# EAGLE design roller_sensor (EAGLE 5.03)
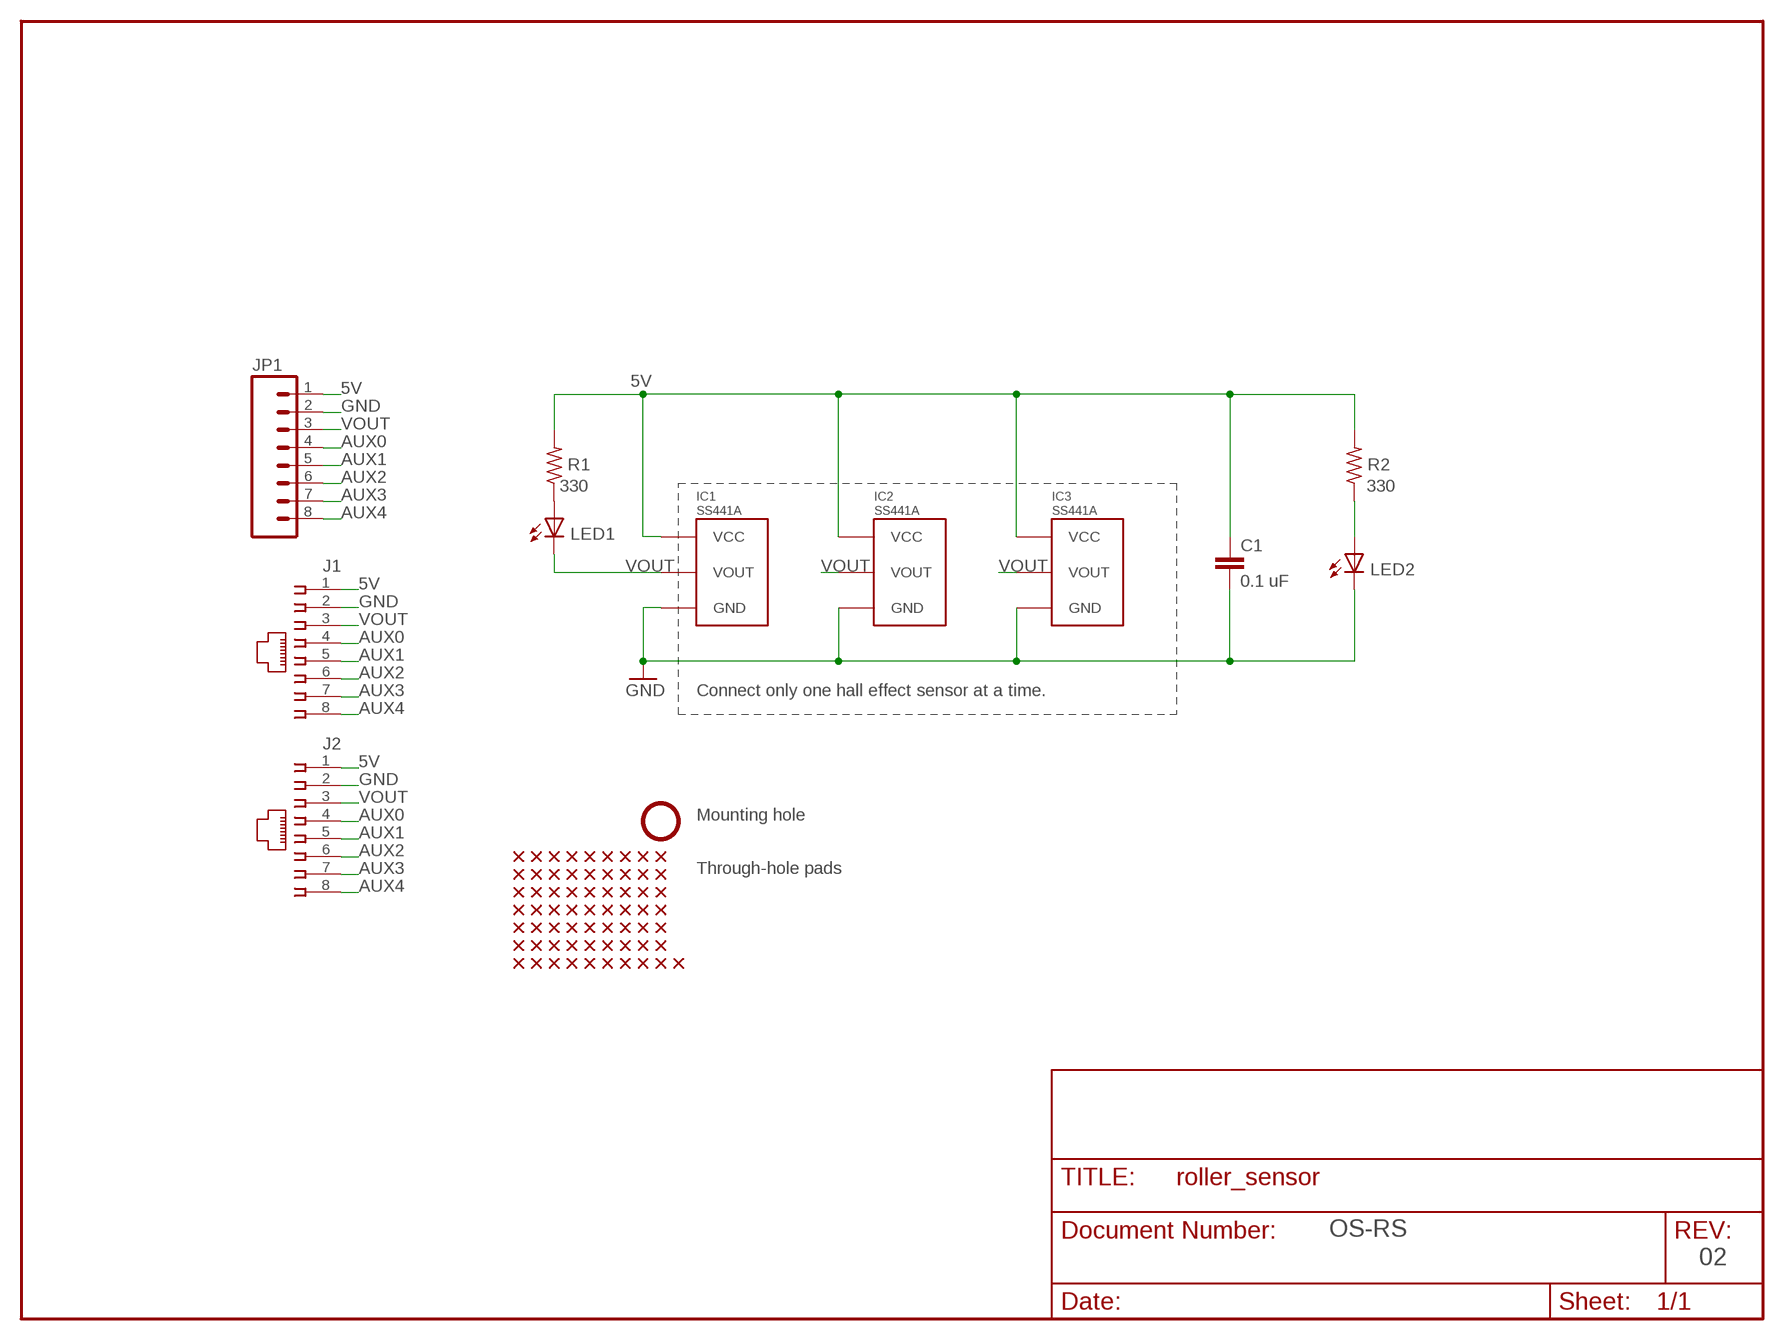
[diagram p0: schematic, sheet 1]

## Parts
C1  0.1 uF  C-EU025-025X050  [C025-025X050]
IC1  SS441A  [A3245]
IC2  SS441A  [A3245]
IC3  SS441A  [A3245]
J1  555164-1  [555164-1]
J2  555164-1  [555164-1]
JP1  M08  [1X08]
LED1  LED5MM  [LED5MM]
LED2  LED3MM  [LED3MM]
R1  330  R-US_V234/12  [V234/12]
R2  330  R-US_V234/12  [V234/12]
U$1  THRUHOLE_X  [THRUHOLE]
U$2  THRUHOLE_X  [THRUHOLE]
U$3  THRUHOLE_X  [THRUHOLE]
U$4  THRUHOLE_X  [THRUHOLE]
U$5  MOUNTING_HOLE  [SCREWHOLE_SERPAC_C-6_HOLE]
U$6  THRUHOLE_X  [THRUHOLE]
U$7  THRUHOLE_X  [THRUHOLE]
U$9  THRUHOLE_X  [THRUHOLE]
U$10  THRUHOLE_X  [THRUHOLE]
U$11  THRUHOLE_X  [THRUHOLE]
U$12  THRUHOLE_X  [THRUHOLE]
U$13  THRUHOLE_X  [THRUHOLE]
U$14  THRUHOLE_X  [THRUHOLE]
U$15  THRUHOLE_X  [THRUHOLE]
U$16  THRUHOLE_X  [THRUHOLE]
U$17  THRUHOLE_X  [THRUHOLE]
U$18  THRUHOLE_X  [THRUHOLE]
U$19  THRUHOLE_X  [THRUHOLE]
U$20  THRUHOLE_X  [THRUHOLE]
U$22  THRUHOLE_X  [THRUHOLE]
U$26  THRUHOLE_X  [THRUHOLE]
U$27  THRUHOLE_X  [THRUHOLE]
U$28  THRUHOLE_X  [THRUHOLE]
U$29  THRUHOLE_X  [THRUHOLE]
U$30  THRUHOLE_X  [THRUHOLE]
U$31  THRUHOLE_X  [THRUHOLE]
U$32  THRUHOLE_X  [THRUHOLE]
U$33  THRUHOLE_X  [THRUHOLE]
U$34  THRUHOLE_X  [THRUHOLE]
U$35  THRUHOLE_X  [THRUHOLE]
U$36  THRUHOLE_X  [THRUHOLE]
U$37  THRUHOLE_X  [THRUHOLE]
U$38  THRUHOLE_X  [THRUHOLE]
U$39  THRUHOLE_X  [THRUHOLE]
U$41  THRUHOLE_X  [THRUHOLE]
U$42  THRUHOLE_X  [THRUHOLE]
U$43  THRUHOLE_X  [THRUHOLE]
U$44  THRUHOLE_X  [THRUHOLE]
U$45  THRUHOLE_X  [THRUHOLE]
U$46  THRUHOLE_X  [THRUHOLE]
U$54  THRUHOLE_X  [THRUHOLE]
U$55  THRUHOLE_X  [THRUHOLE]
U$56  THRUHOLE_X  [THRUHOLE]
U$57  THRUHOLE_X  [THRUHOLE]
U$58  THRUHOLE_X  [THRUHOLE]
U$59  THRUHOLE_X  [THRUHOLE]
U$60  THRUHOLE_X  [THRUHOLE]
U$61  THRUHOLE_X  [THRUHOLE]
U$62  THRUHOLE_X  [THRUHOLE]
U$63  THRUHOLE_X  [THRUHOLE]
U$64  THRUHOLE_X  [THRUHOLE]
U$65  THRUHOLE_X  [THRUHOLE]
U$67  THRUHOLE_X  [THRUHOLE]
U$68  THRUHOLE_X  [THRUHOLE]
U$72  THRUHOLE_X  [THRUHOLE]
U$73  THRUHOLE_X  [THRUHOLE]
U$75  THRUHOLE_X  [THRUHOLE]
U$76  THRUHOLE_X  [THRUHOLE]
U$77  THRUHOLE_X  [THRUHOLE]
U$78  THRUHOLE_X  [THRUHOLE]
U$80  THRUHOLE_X  [THRUHOLE]
U$81  THRUHOLE_X  [THRUHOLE]
U$82  THRUHOLE_X  [THRUHOLE]
U$83  THRUHOLE_X  [THRUHOLE]
U$85  THRUHOLE_X  [THRUHOLE]

## Nets
5V: C1.1 IC1.VCC IC2.VCC IC3.VCC J1.1 J2.1 JP1.1 R1.2 R2.2
AUX0: J1.4 J2.4 JP1.4
AUX1: J1.5 J2.5 JP1.5
AUX2: J1.6 J2.6 JP1.6
AUX3: J1.7 J2.7 JP1.7
AUX4: J1.8 J2.8 JP1.8
GND: C1.2 IC1.GND IC2.GND IC3.GND J1.2 J2.2 JP1.2 LED2.K(C)
N$12: LED2.A R2.1
N$13: LED1.A R1.1
VOUT: IC1.VOUT IC2.VOUT IC3.VOUT J1.3 J2.3 JP1.3 LED1.K(C)
Unconnected: U$1.P$1 U$2.P$1 U$3.P$1 U$4.P$1 U$6.P$1 U$7.P$1 U$9.P$1 U$10.P$1 U$11.P$1 U$12.P$1 U$13.P$1 U$14.P$1 U$15.P$1 U$16.P$1 U$17.P$1 U$18.P$1 U$19.P$1 U$20.P$1 U$22.P$1 U$26.P$1 U$27.P$1 U$28.P$1 U$29.P$1 U$30.P$1 U$31.P$1 U$32.P$1 U$33.P$1 U$34.P$1 U$35.P$1 U$36.P$1 U$37.P$1 U$38.P$1 U$39.P$1 U$41.P$1 U$42.P$1 U$43.P$1 U$44.P$1 U$45.P$1 U$46.P$1 U$54.P$1 U$55.P$1 U$56.P$1 U$57.P$1 U$58.P$1 U$59.P$1 U$60.P$1 U$61.P$1 U$62.P$1 U$63.P$1 U$64.P$1 U$65.P$1 U$67.P$1 U$68.P$1 U$72.P$1 U$73.P$1 U$75.P$1 U$76.P$1 U$77.P$1 U$78.P$1 U$80.P$1 U$81.P$1 U$82.P$1 U$83.P$1 U$85.P$1

## Notes on the sheet
- Connect only one hall effect sensor at a time.
- Mounting hole
- Through-hole pads
- OS-RS
- 02

## Library data of the parts
C1 = rcl:C-EU: CAPACITOR, European symbol
IC1-IC3 = roller_sensor:SS441A
J1 J2 = roller_sensor:555164-1: AMP connector
JP1 = SparkFun:M08: Header 8 Standard 8-pin 0.1" header. Use with straight break away headers (SKU : PRT-00116), right angle break away headers (PRT-00553), swiss pins (PRT-00743), machine pins (PRT-00117), and female headers (PRT-00115).
LED1 LED2 = led:LED: LED OSRAM: - CHIPLED LG R971, LG N971, LY N971, LG Q971, LY Q971, LO R971, LY R971 LH N974, LH R974 LS Q976, LO Q976, LY Q976 LO Q996 - Hyper CHIPLED LW Q18S LB Q993, LB Q99A, LB R99A - SideLED LS A670, LO A670, LY A670, LG A670, LP A670 LB A673, LV A673, LT A673, LW A673 LH A674 LY A675 LS A676, LA A676, LO A676, LY A676, LW A676 LS A679, LY A679, LG A679 - Hyper Micro SIDELED® LS Y876, LA Y876, LO Y876, LY Y876 LT Y87S - SmartLED LW L88C, LW L88S LB L89C, LB L89S, LG L890 LS L89K, LO L89K, LY L89K LS L896, LA L896, LO L896, LY L896 - TOPLED LS T670, LO T670, LY T670, LG T670, LP T670 LSG T670, LSP T670, LSY T670, LOP T670, LYG T670 LG T671, LOG T671, LSG T671 LB T673, LV T673, LT T673, LW T673 LH T674 LS T676, LA T676, LO T676, LY T676, LB T676, LH T676, LSB T676, LW T676 LB T67C, LV T67C, LT T67C, LS T67K, LO T67K, LY T67K, LW E67C LS E67B, LA E67B, LO E67B, LY E67B, LB E67C, LV E67C, LT E67C LW T67C LS T679, LY T679, LG T679 LS T770, LO T770, LY T770, LG T770, LP T770 LB T773, LV T773, LT T773, LW T773 LH T774 LS E675, LA E675, LY E675, LS T675 LS T776, LA T776, LO T776, LY T776, LB T776 LHGB T686 LT T68C, LB T68C - Hyper Mini TOPLED® LB M676 - Mini TOPLED Santana® LG M470 LS M47K, LO M47K, LY M47K Source: http://www.osram.convergy.de LUXEON: - LUMILED® LXK2-PW12-R00, LXK2-PW12-S00, LXK2-PW14-U00, LXK2-PW14-V00 LXK2-PM12-R00, LXK2-PM12-S00, LXK2-PM14-U00 LXK2-PE12-Q00, LXK2-PE12-R00, LXK2-PE12-S00, LXK2-PE14-T00, LXK2-PE14-U00 LXK2-PB12-K00, LXK2-PB12-L00, LXK2-PB12-M00, LXK2-PB14-N00, LXK2-PB14-P00, LXK2-PB14-Q00 LXK2-PR12-L00, LXK2-PR12-M00, LXK2-PR14-Q00, LXK2-PR14-R00 LXK2-PD12-Q00, LXK2-PD12-R00, LXK2-PD12-S00 LXK2-PH12-R00, LXK2-PH12-S00 LXK2-PL12-P00, LXK2-PL12-Q00, LXK2-PL12-R00 Source: www.luxeon.com KINGBRIGHT: KA-3528ASYC Source: www.kingbright.com
R1 R2 = rcl:R-US_: RESISTOR, American symbol
U$1-U$4 U$6 U$7 U$9-U$20 U$22 U$26-U$39 U$41-U$46 U$54-U$65 U$67 U$68 U$72 U$73 U$75-U$78 U$80-U$83 U$85 = roller_sensor:THRUHOLE
U$5 = roller_sensor:MOUNTING_HOLE

## Board
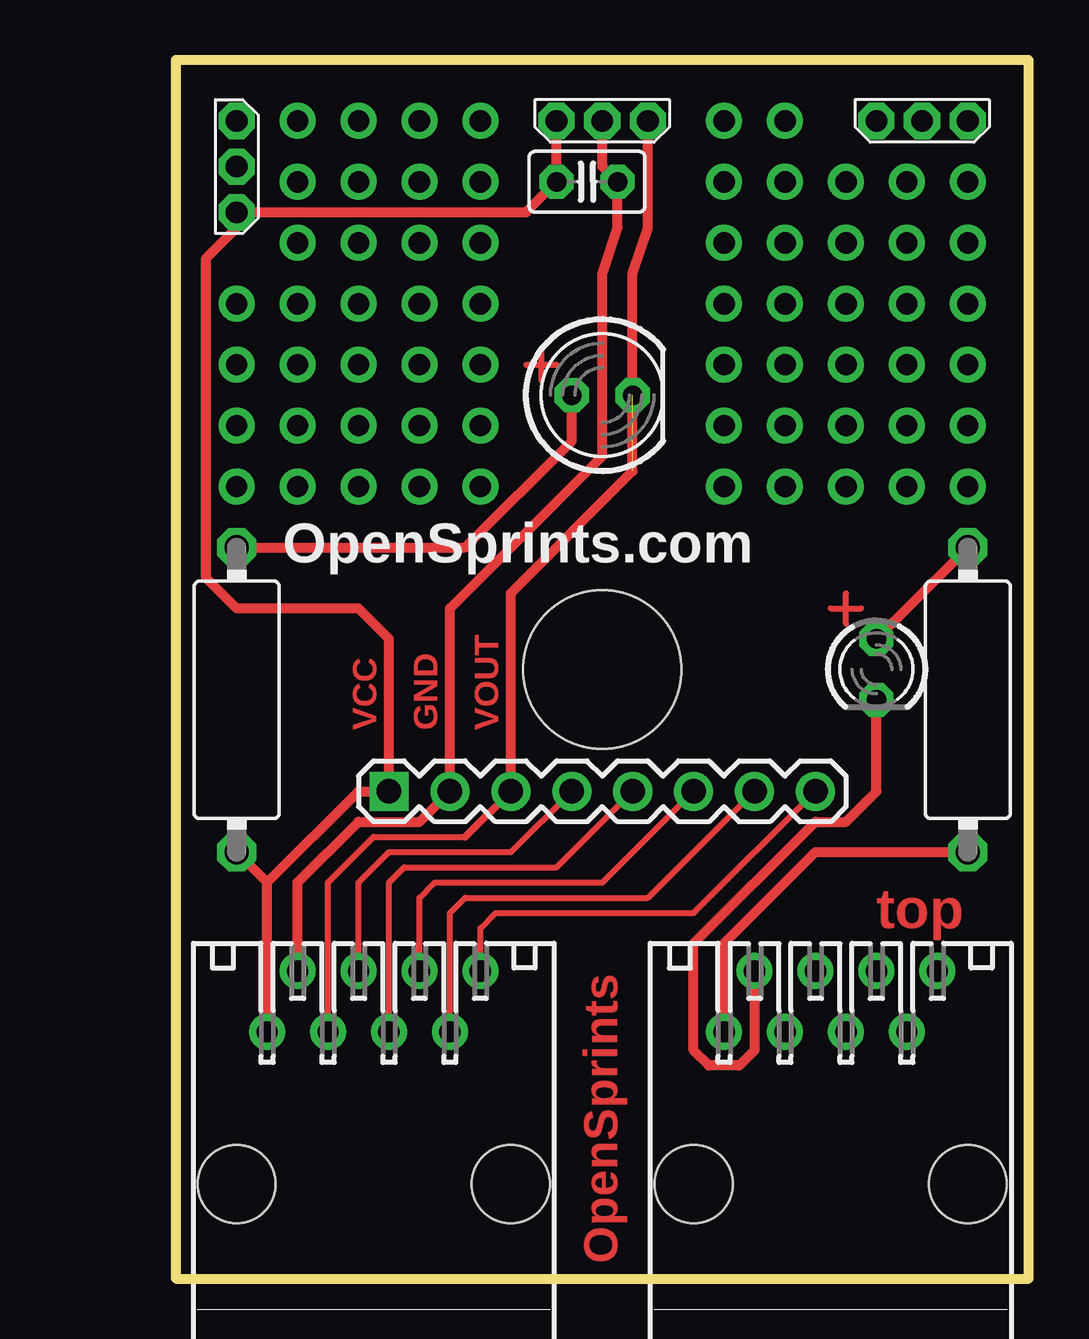
[diagram p1: board, top side]
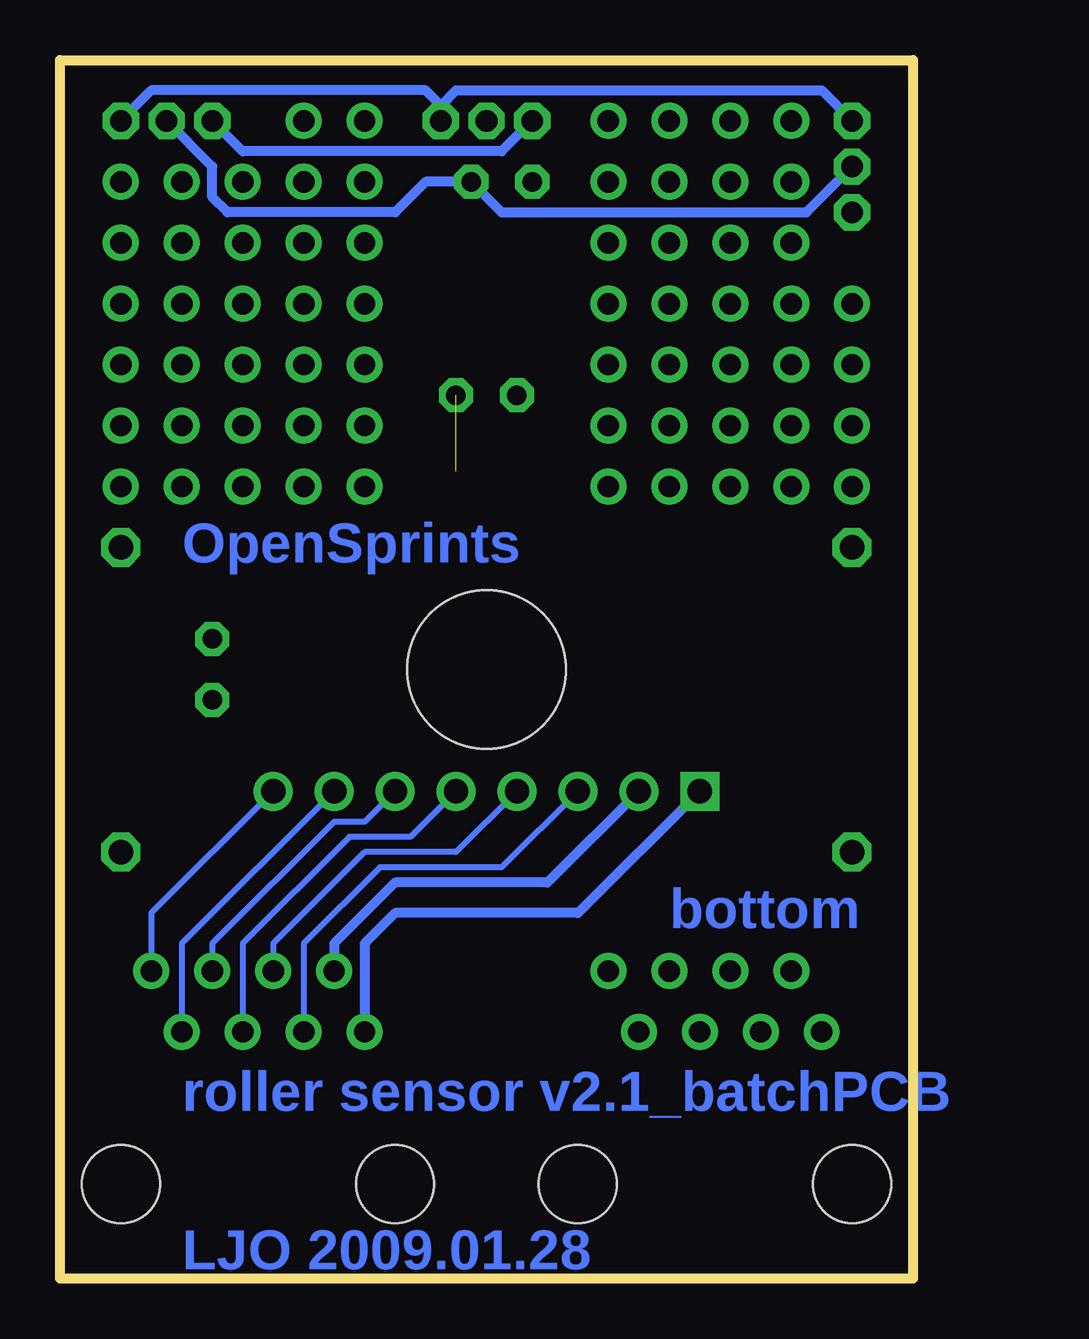
[diagram p2: board, bottom side, seen from below]

Size 35.56 x 50.8 mm. Coordinates in mm from the lower left corner, seen from the top.
Outline: 0,0 35.56,0 35.56,50.8 0,50.8 0,0
Copper layers (1*16): Top 0.035mm / dielectric 1.5mm / Bottom 0.035mm
Design rules "SparkFun": minimum track width 8mil, minimum drill 20mil, track to track 8mil, track to pad 8mil, pad to pad 8mil, via to via 8mil, smd to smd 8mil, copper to edge 10mil, drill to drill 8mil, minimum pad ring 12mil, minimum via ring 10mil, stop-mask expansion 4mil, vias tented up to drill 25mil, thermal gap 10mil

### Footprints (pad centres in the part's own frame; a part is rotated, then mirrored left to right if it is on the bottom)
C025-025X050 = drill 0.813 octagon: 1 -1.27,0; 2 1.27,0
A3245 = drill 0.9 pad 1.016 octagon: GND 0,0; VCC 0,-1.905; VOUT 0,1.905
555164-1 = drill 0.889 round: 1 -4.445,5.207; 2 -3.175,7.747; 3 -1.905,5.207; 4 -0.635,7.747; 5 0.635,5.207; 6 1.905,7.747; 7 3.175,5.207; 8 4.445,7.747 | hole 3.251: -5.715,-1.143; 5.715,-1.143
1X08 = drill 1.016 square: 1 0,0 | drill 1.016 round: 2 2.54,0; 3 5.08,0; 4 7.62,0; 5 10.16,0; 6 12.7,0; 7 15.24,0; 8 17.78,0
LED5MM = drill 0.813 octagon: A -1.27,0; K 1.27,0
LED3MM = drill 0.813 octagon: A -1.27,0; K 1.27,0
V234/12 = drill 1.016 octagon: 1 -6.35,0; 2 6.35,0
THRUHOLE = drill 0.889 round: P$1 0,0
SCREWHOLE_SERPAC_C-6_HOLE = hole 6.604: 0,0

### Placement (x,y rotation side)
C1  17.14,45.72 0 top
IC1  17.78,48.26 270 top
IC2  2.54,46.35 0 top
IC3  31.11,48.26 270 top
J1  8.26,5.08 0 top
J2  27.3,5.08 0 top
JP1  8.89,20.32 0 top
LED1  17.78,36.83 0 top
LED2  29.21,25.4 270 top
R1  2.54,24.13 270 top
R2  33.02,24.13 270 top
U$1  22.86,48.26 0 top
U$2  7.62,48.26 0 top
U$3  25.4,48.26 0 top
U$4  2.54,38.1 0 top
U$5  17.78,25.4 0 top
U$6  2.54,33.02 0 top
U$7  33.02,43.18 0 top
U$9  12.7,48.26 0 top
U$10  7.62,43.18 0 top
U$11  12.7,43.18 0 top
U$12  7.62,38.1 0 top
U$13  12.7,38.1 0 top
U$14  7.62,33.02 0 top
U$15  12.7,33.02 0 top
U$16  10.16,48.26 0 top
U$17  5.08,38.1 90 top
U$18  10.16,43.18 0 top
U$19  5.08,33.02 0 top
U$20  10.16,38.1 0 top
U$22  10.16,33.02 0 top
U$26  22.86,43.18 0 top
U$27  27.94,43.18 0 top
U$28  7.62,45.72 0 top
U$29  12.7,45.72 0 top
U$30  22.86,38.1 0 top
U$31  27.94,38.1 0 top
U$32  7.62,40.64 0 top
U$33  12.7,40.64 0 top
U$34  22.86,33.02 0 top
U$35  27.94,33.02 0 top
U$36  7.62,35.56 0 top
U$37  12.7,35.56 0 top
U$38  33.02,38.1 0 top
U$39  33.02,45.72 0 top
U$41  33.02,40.64 0 top
U$42  30.48,33.02 0 top
U$43  5.08,48.26 0 top
U$44  2.54,40.64 0 top
U$45  33.02,35.56 0 top
U$46  2.54,35.56 0 top
U$54  5.08,45.72 0 top
U$55  10.16,45.72 0 top
U$56  5.08,35.56 0 top
U$57  22.86,45.72 0 top
U$58  27.94,45.72 0 top
U$59  5.08,43.18 0 top
U$60  10.16,40.64 0 top
U$61  33.02,33.02 0 top
U$62  22.86,40.64 0 top
U$63  27.94,40.64 0 top
U$64  5.08,40.64 0 top
U$65  10.16,35.56 0 top
U$67  22.86,35.56 0 top
U$68  27.94,35.56 0 top
U$72  25.4,45.72 0 top
U$73  30.48,45.72 0 top
U$75  25.4,43.18 0 top
U$76  30.48,43.18 0 top
U$77  25.4,40.64 0 top
U$78  30.48,40.64 0 top
U$80  25.4,38.1 0 top
U$81  30.48,38.1 0 top
U$82  25.4,35.56 0 top
U$83  30.48,35.56 0 top
U$85  25.4,33.02 0 top

### Tracks (layer width: path | path; a pad name or v marks a point on that pad's centre or on a via)
5V
  Top 0.254: 10.16,44.45 9.53,44.45
  Top 0.406: IC1.VCC C1.1 14.61,44.45 10.16,44.45 IC2.VCC 2.54,43.81 1.27,42.55 1.27,29.21 2.54,27.94 7.62,27.94 8.89,26.67 JP1.1 7.62,20.32 3.81,16.51 | J1.1 3.81,16.51 | 3.81,16.51 R1.2 | R2.2 26.67,17.78 22.86,13.97 J2.1
  Bottom 0.406: IC3.VCC 27.94,46.99 17.14,46.99 IC1.VCC | JP1.1 13.97,15.24 21.59,15.24 22.86,13.97 J2.1
AUX0
  Top 0.254: J1.4 7.62,16.51 8.89,17.78 13.97,17.78 JP1.4
  Bottom 0.254: J2.4 26.67,13.97 22.86,17.78 19.05,17.78 JP1.4
AUX1
  Top 0.254: J1.5 8.89,16.51 9.53,17.14 15.88,17.14 JP1.5
  Bottom 0.254: J2.5 27.94,13.97 23.5,18.41 20.95,18.41 JP1.5
AUX2
  Top 0.254: J1.6 10.16,15.88 10.79,16.51 17.78,16.51 JP1.6
  Bottom 0.254: J2.6 29.21,13.97 24.13,19.05 22.86,19.05 JP1.6
AUX3
  Top 0.254: J1.7 11.43,15.24 12.06,15.88 19.68,15.88 JP1.7
  Bottom 0.254: J2.7 30.48,13.97 JP1.7
AUX4
  Top 0.254: J1.8 12.7,14.61 13.34,15.24 21.59,15.24 JP1.8
  Bottom 0.254: J2.8 31.75,15.24 JP1.8
GND
  Top 0.406: LED2.K 29.21,20.32 27.94,19.05 26.67,19.05 21.59,13.97 21.59,9.53 22.23,8.89 23.5,8.89 24.13,9.53 J2.2 | J1.2 5.08,16.51 7.62,19.05 10.16,19.05 JP1.2 11.43,27.94 17.78,34.29 17.78,41.91 18.41,43.81 C1.2 17.78,46.35 IC1.GND
  Bottom 0.406: J2.2 24.13,13.97 21.59,16.51 15.24,16.51 JP1.2 | IC3.GND 29.21,46.35 29.21,45.09 28.57,44.45 21.59,44.45 20.32,45.72 C1.2 17.14,44.45 4.45,44.45 IC2.GND
N$7
  Top 0.254: 27.94,27.3 27.94,28.57
N$8
  Top 0.254: 27.3,27.94 28.57,27.94
N$9
  Top 0.254: 15.24,37.47 15.24,38.73
N$10
  Top 0.254: 14.61,38.1 15.88,38.1
N$12
  Top 0.406: LED2.A R2.1
N$13
  Top 0.406: R1.1 12.06,30.48 16.51,34.92 LED1.A
VOUT  (1 unrouted)
  Top 0.254: J1.3 6.35,16.51 8.26,18.41 12.06,18.41
  Top 0.305: 12.06,18.41 JP1.3
  Top 0.406: JP1.3 13.97,28.57 19.05,33.66 19.05,41.91 19.68,43.81 IC1.VOUT
  Bottom 0.254: J2.3 25.4,13.97 22.23,17.14 17.14,17.14 JP1.3
  Bottom 0.406: IC3.VOUT 31.75,49.53 20.32,49.53 19.68,48.9 | 19.68,48.9 19.05,49.53 3.81,49.53 IC2.VOUT | IC1.VOUT 19.68,48.9

### Text on the board
Top: VCC | GND | VOUT | top | OpenSprints
Bottom: OpenSprints | bottom | roller sensor v2.1_batchPCB | LJO 2009.01.28
_tsilk: OpenSprints.com